# EAGLE schematic 261503933xxxx_HW-V2 (EAGLE 7.7.0)
PROJECT_NAME: Adrastea-I FeatherWing board

## Sheet 1 of 3
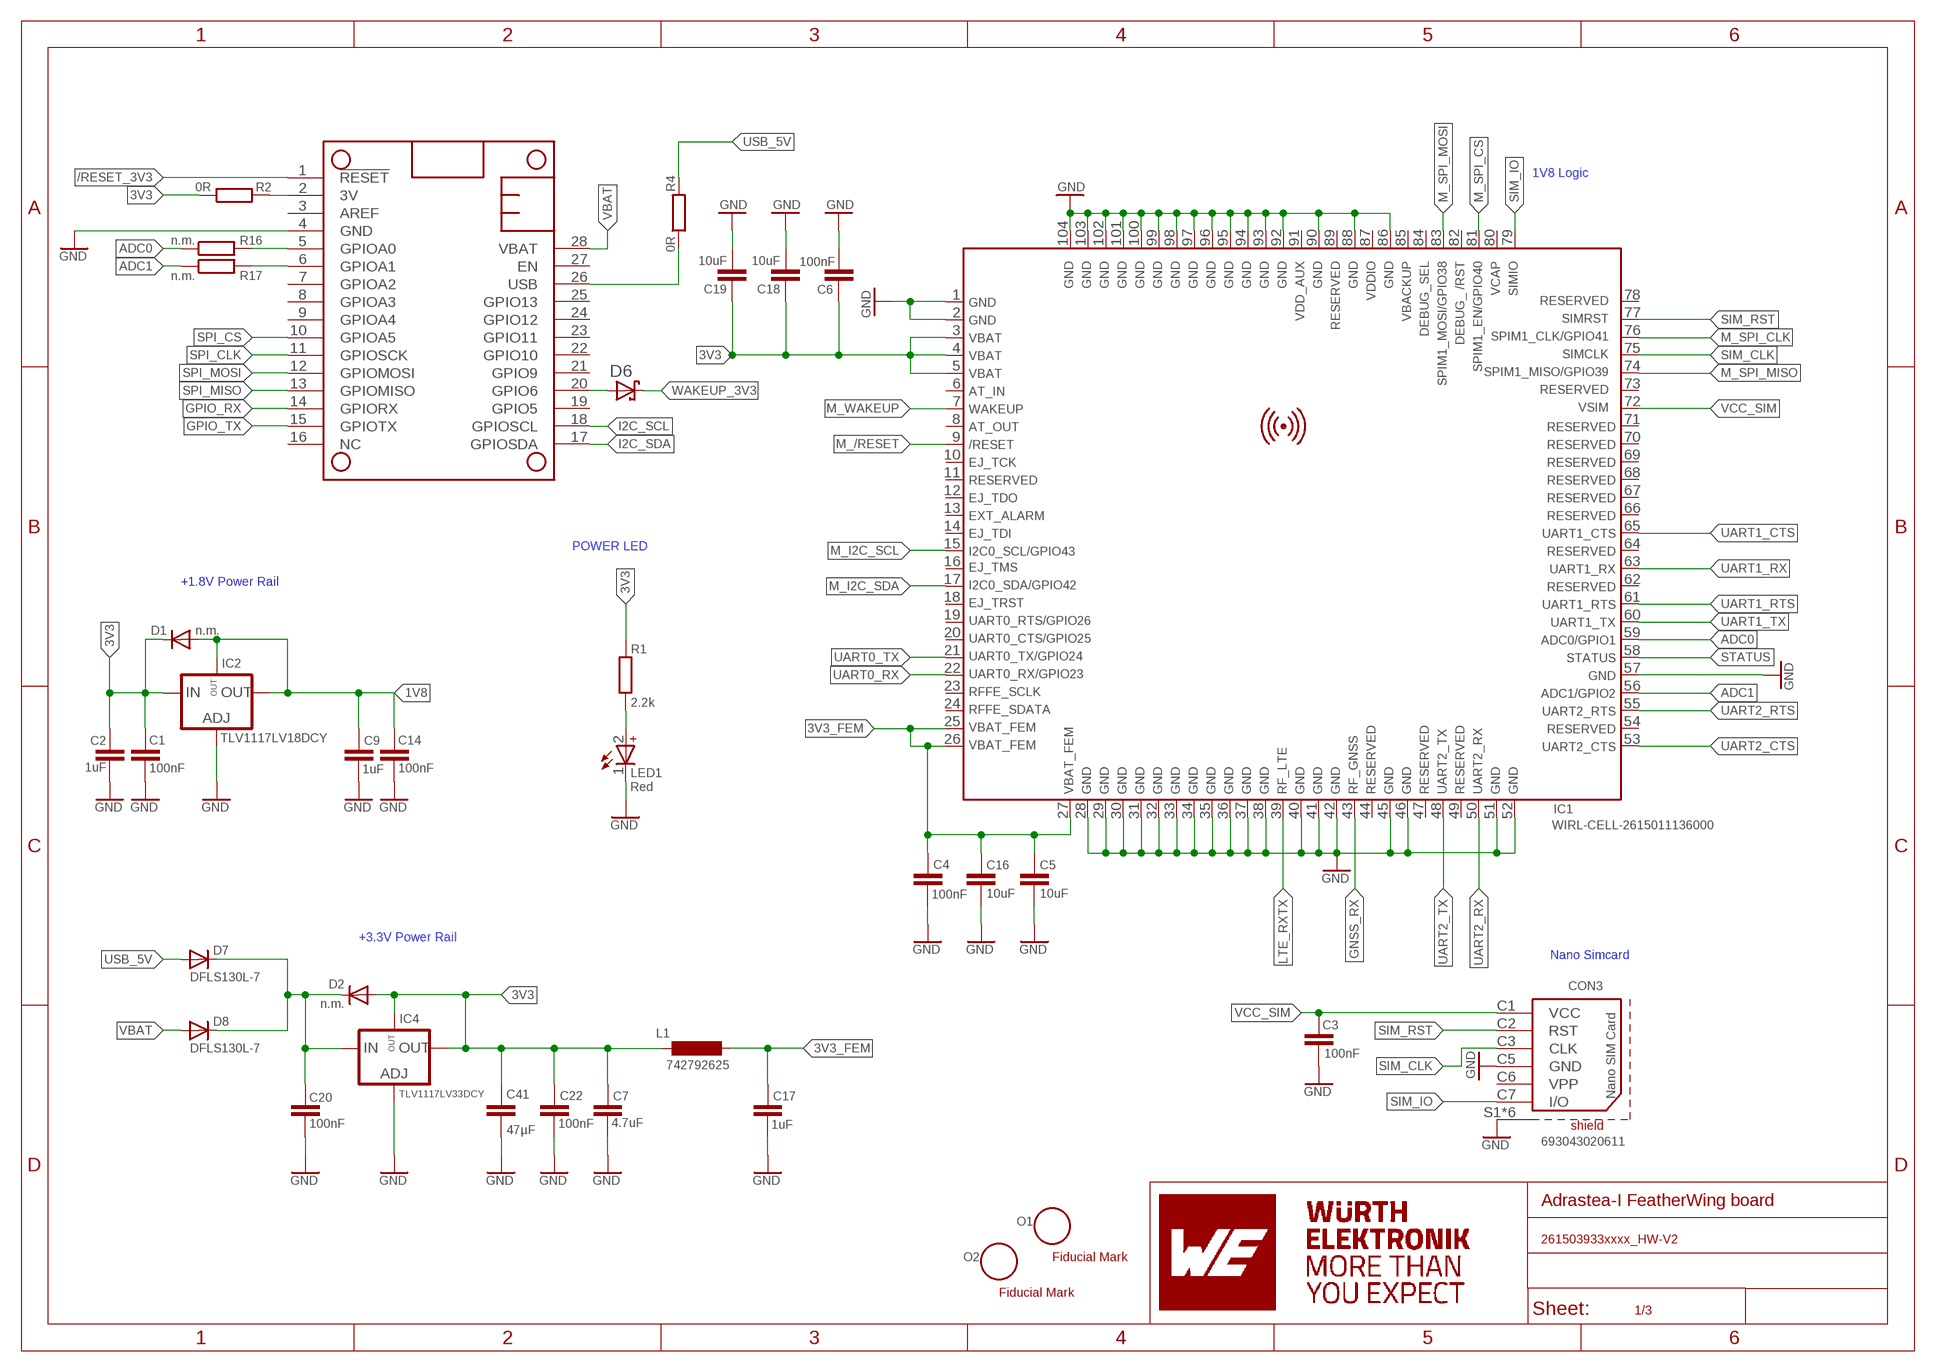
[diagram p0: schematic, sheet 1]

### Parts
C1  100nF  C0402_IPC  [C0402_IPC]
C2  1uF  C1UF0402_IPC  [C0402_IPC]
C3  100nF  C100NF0402_IPC  [C0402_IPC]
C4  100nF  C0402_IPC  [C0402_IPC]
C5  10uF  C0402_IPC  [C0402_IPC]
C6  100nF  C0402_IPC  [C0402_IPC]
C7  4.7uF  C4.7UF0402_IPC  [C0402_IPC]
C9  1uF  C1UF0402_IPC  [C0402_IPC]
C14  100nF  C0402_IPC  [C0402_IPC]
C16  10uF  C0402_IPC  [C0402_IPC]
C17  1uF  C1UF0402_IPC  [C0402_IPC]
C18  10uF  C0402_IPC  [C0402_IPC]
C19  10uF  C0402_IPC  [C0402_IPC]
C20  100nF  C0402_IPC  [C0402_IPC]
C22  100nF  C0402_IPC  [C0402_IPC]
C41  47µF  C47UF0805  [C0805]
CON3  693043020611  [693043020611]
D1  n.m.  BAS16  [SOT23@1]
D2  n.m.  BAS16  [SOT23@1]
D6  BAT540402_X1-DFN1006-2  [X1-DFN1006-2]
D7  DFLS130L-7  [SOD123_POWERDI]
D8  DFLS130L-7  [SOD123_POWERDI]
IC1  WIRL-CELL-2615011136000  [WIRL-CELL-2615011136000]
IC2  TLV1117LV18DCY  TLV1117-XXIDCYR  [SOT223-4]
IC4  TLV1117LV33DCY  TLV1117-XXIDCYR  [SOT223-4]
L1  742792625  LL0603_WE-MK  [L0603_WE-MK]
LED1  Red  WL-SMSW_1204_155124RS73200  [WL-SMSW_1204_A]
MS1  FEATHERWING_80MM  [FEATHERWING_80MM]
O1  OPT_MARKE05  [OPT_M_05]
O2  OPT_MARKE05  [OPT_M_05]
R1  2.2k  R2K20402_IPC  [R0402_IPC]
R2  0R  R0R0603_IPC  [R0603_IPC]
R4  0R  R0R0603_IPC  [R0603_IPC]
R16  n.m.  R0402_IPC  [R0402_IPC]
R17  n.m.  R0402_IPC  [R0402_IPC]

### Nets
1V8: C9.1 C14.2 D1.1(A) IC2.2(OUT) IC2.4(OUT) ; also sheet 2
3V: MS1.2(3V) R2.2
3V3: C1.2 C2.1 C6.2 C7.1 C18.1 C19.1 C22.2 C41.P$1 D1.3(C) D2.1(A) IC1.3(VBAT) IC1.4(VBAT) IC1.5(VBAT) IC2.3(IN) IC4.2(OUT) IC4.4(OUT) L1.1 R1.2 R2.1 ; also sheet 2,3
3V3_FEM: C4.2 C5.1 C16.1 C17.1 IC1.25(VBAT_FEM) IC1.26(VBAT_FEM) IC1.27(VBAT_FEM) L1.2
5V_IN: C20.2 D2.3(C) D7.K(C) D8.K(C) IC4.3(IN)
/RESET_3V3: MS1.1(!RESET) ; also sheet 2
ADC0: IC1.59(ADC0/GPIO1) R16.1
ADC1: IC1.56(ADC1/GPIO2) R17.1
ADC_0: MS1.5(GPIOA0) R16.2
ADC_1: MS1.6(GPIOA1) R17.2
FEATHER_USB: MS1.26(USB) R4.1
GND: C1.1 C2.2 C3.2 C4.1 C5.2 C6.1 C7.2 C9.2 C14.1 C16.2 C17.2 C18.2 C19.2 C20.1 C22.1 C41.P$2 CON3.C5(GND) CON3.S1(SHIELD) CON3.S2(SHIELD) CON3.S3(SHIELD) CON3.S4(SHIELD) CON3.S5(SHIELD) CON3.S6(SHIELD) IC1.1(GND) IC1.2(GND) IC1.28(GND) IC1.29(GND) IC1.30(GND) IC1.31(GND) IC1.32(GND) IC1.33(GND) IC1.34(GND) IC1.35(GND) IC1.36(GND) IC1.37(GND) IC1.38(GND) IC1.40(GND) IC1.41(GND) IC1.42(GND) IC1.45(GND) IC1.46(GND) IC1.51(GND) IC1.52(GND) IC1.57(GND) IC1.86(GND) IC1.88(GND) IC1.90(GND) IC1.92(GND) IC1.93(GND) IC1.94(GND) IC1.95(GND) IC1.96(GND) IC1.97(GND) IC1.98(GND) IC1.99(GND) IC1.100(GND) IC1.101(GND) IC1.102(GND) IC1.103(GND) IC1.104(GND) IC2.1(ADJ) IC4.1(ADJ) LED1.1(-) MS1.4(GND) ; also sheet 2,3
GNSS_RX: IC1.43(RF_GNSS_ANT) ; also sheet 2
GPIO_RX: MS1.14(GPIORX) ; also sheet 2,3
GPIO_TX: MS1.15(GPIOTX) ; also sheet 2,3
I2C_SCL: MS1.18(GPIOSCL) ; also sheet 2
I2C_SDA: MS1.17(GPIOSDA) ; also sheet 2
LTE_RXTX: IC1.39(RF_RXTX) ; also sheet 2
M_/RESET: IC1.9(/RESET) ; also sheet 2
M_I2C_SCL: IC1.15(I2C0_SCL/GPIO43) ; also sheet 2
M_I2C_SDA: IC1.17(I2C0_SDA/GPIO42) ; also sheet 2
M_SPI_CLK: IC1.76(SPIM1_CLK/GPIO41) ; also sheet 2
M_SPI_CS: IC1.81(SPIM1_EN/GPIO40) ; also sheet 2
M_SPI_MISO: IC1.74(SPIM1_MISO/GPIO39) ; also sheet 2
M_SPI_MOSI: IC1.83(SPIM1_MOSI/GPIO38) ; also sheet 2
M_WAKEUP: IC1.7(WAKEUP) ; also sheet 2
N$1: LED1.2(+) R1.1
N$3: D6.2(A) MS1.20(GPIO6)
SIM_CLK: CON3.C3(CLK) IC1.75(SIMCLK)
SIM_IO: CON3.C7(I/O) IC1.79(SIMIO)
SIM_RST: CON3.C2(RST) IC1.77(SIMRST)
SPI_CLK: MS1.11(GPIOSCK) ; also sheet 2
SPI_CS: MS1.10(GPIOA5) ; also sheet 2
SPI_MISO: MS1.13(GPIOMISO) ; also sheet 2
SPI_MOSI: MS1.12(GPIOMOSI) ; also sheet 2
STATUS: IC1.58(STATUS) ; also sheet 2
UART0_RX: IC1.22(UART0_RX/GPIO23) ; also sheet 2
UART0_TX: IC1.21(UART0_TX/GPIO24) ; also sheet 2
UART1_CTS: IC1.65(UART1_CTS) ; also sheet 2
UART1_RTS: IC1.61(UART1_RTS) ; also sheet 2
UART1_RX: IC1.63(UART1_RX) ; also sheet 2
UART1_TX: IC1.60(UART1_TX) ; also sheet 2
UART2_CTS: IC1.53(UART2_CTS) ; also sheet 2
UART2_RTS: IC1.55(UART2_RTS) ; also sheet 2
UART2_RX: IC1.50(UART2_RX) ; also sheet 2
UART2_TX: IC1.48(UART2_TX) ; also sheet 2
USB_5V: D7.A R4.2 ; also sheet 2,3
VBAT: D8.A MS1.28(VBAT) ; also sheet 2
VCC_SIM: C3.1 CON3.C1(VCC) IC1.72(VSIM)
WAKEUP_3V3: D6.1(C) ; also sheet 2
Unconnected: CON3.C6(VPP) IC1.6(AT_IN) IC1.8(PMU_AT_OUT) IC1.10(EJ_TCK) IC1.11(RESERVED14) IC1.12(EJ_TDO) IC1.13(EXT_ALARM) IC1.14(EJ_TDI) IC1.16(EJ_TMS) IC1.18(EJ_TRST) IC1.19(UART0_RTS/GPIO26) IC1.20(UART0_CTS/GPIO25) IC1.23(RFFE_SCLK) IC1.24(RFFE_SDATA) IC1.44(RESERVED5) IC1.47(RESERVED6) IC1.49(RESERVED7) IC1.54(RESERVED15) IC1.62(RESERVED1) IC1.64(RESERVED2) IC1.66(RESERVED8) IC1.67(RESERVED3) IC1.68(RESERVED9) IC1.69(RESERVED4) IC1.70(RESERVED16) IC1.71(RESERVED10) IC1.73(RESERVED11) IC1.78(RESERVED13) IC1.80(VCAP) IC1.82(DEBUG_/RST) IC1.84(DEBUG_SEL) IC1.85(VBACKUP) IC1.87(VDDIO) IC1.89(RESERVED12) IC1.91(VDD_AUX) MS1.3(AREF) MS1.7(GPIOA2) MS1.8(GPIOA3) MS1.9(GPIOA4) MS1.16(NC) MS1.19(GPIO5) MS1.21(GPIO9) MS1.22(GPIO10) MS1.23(GPIO11) MS1.24(GPIO12) MS1.25(GPIO13) MS1.27(EN)

### Notes on the sheet
- 1V8 Logic
- POWER LED
- +1.8V Power Rail
- +3.3V Power Rail
- Nano Simcard

## Sheet 2 of 3
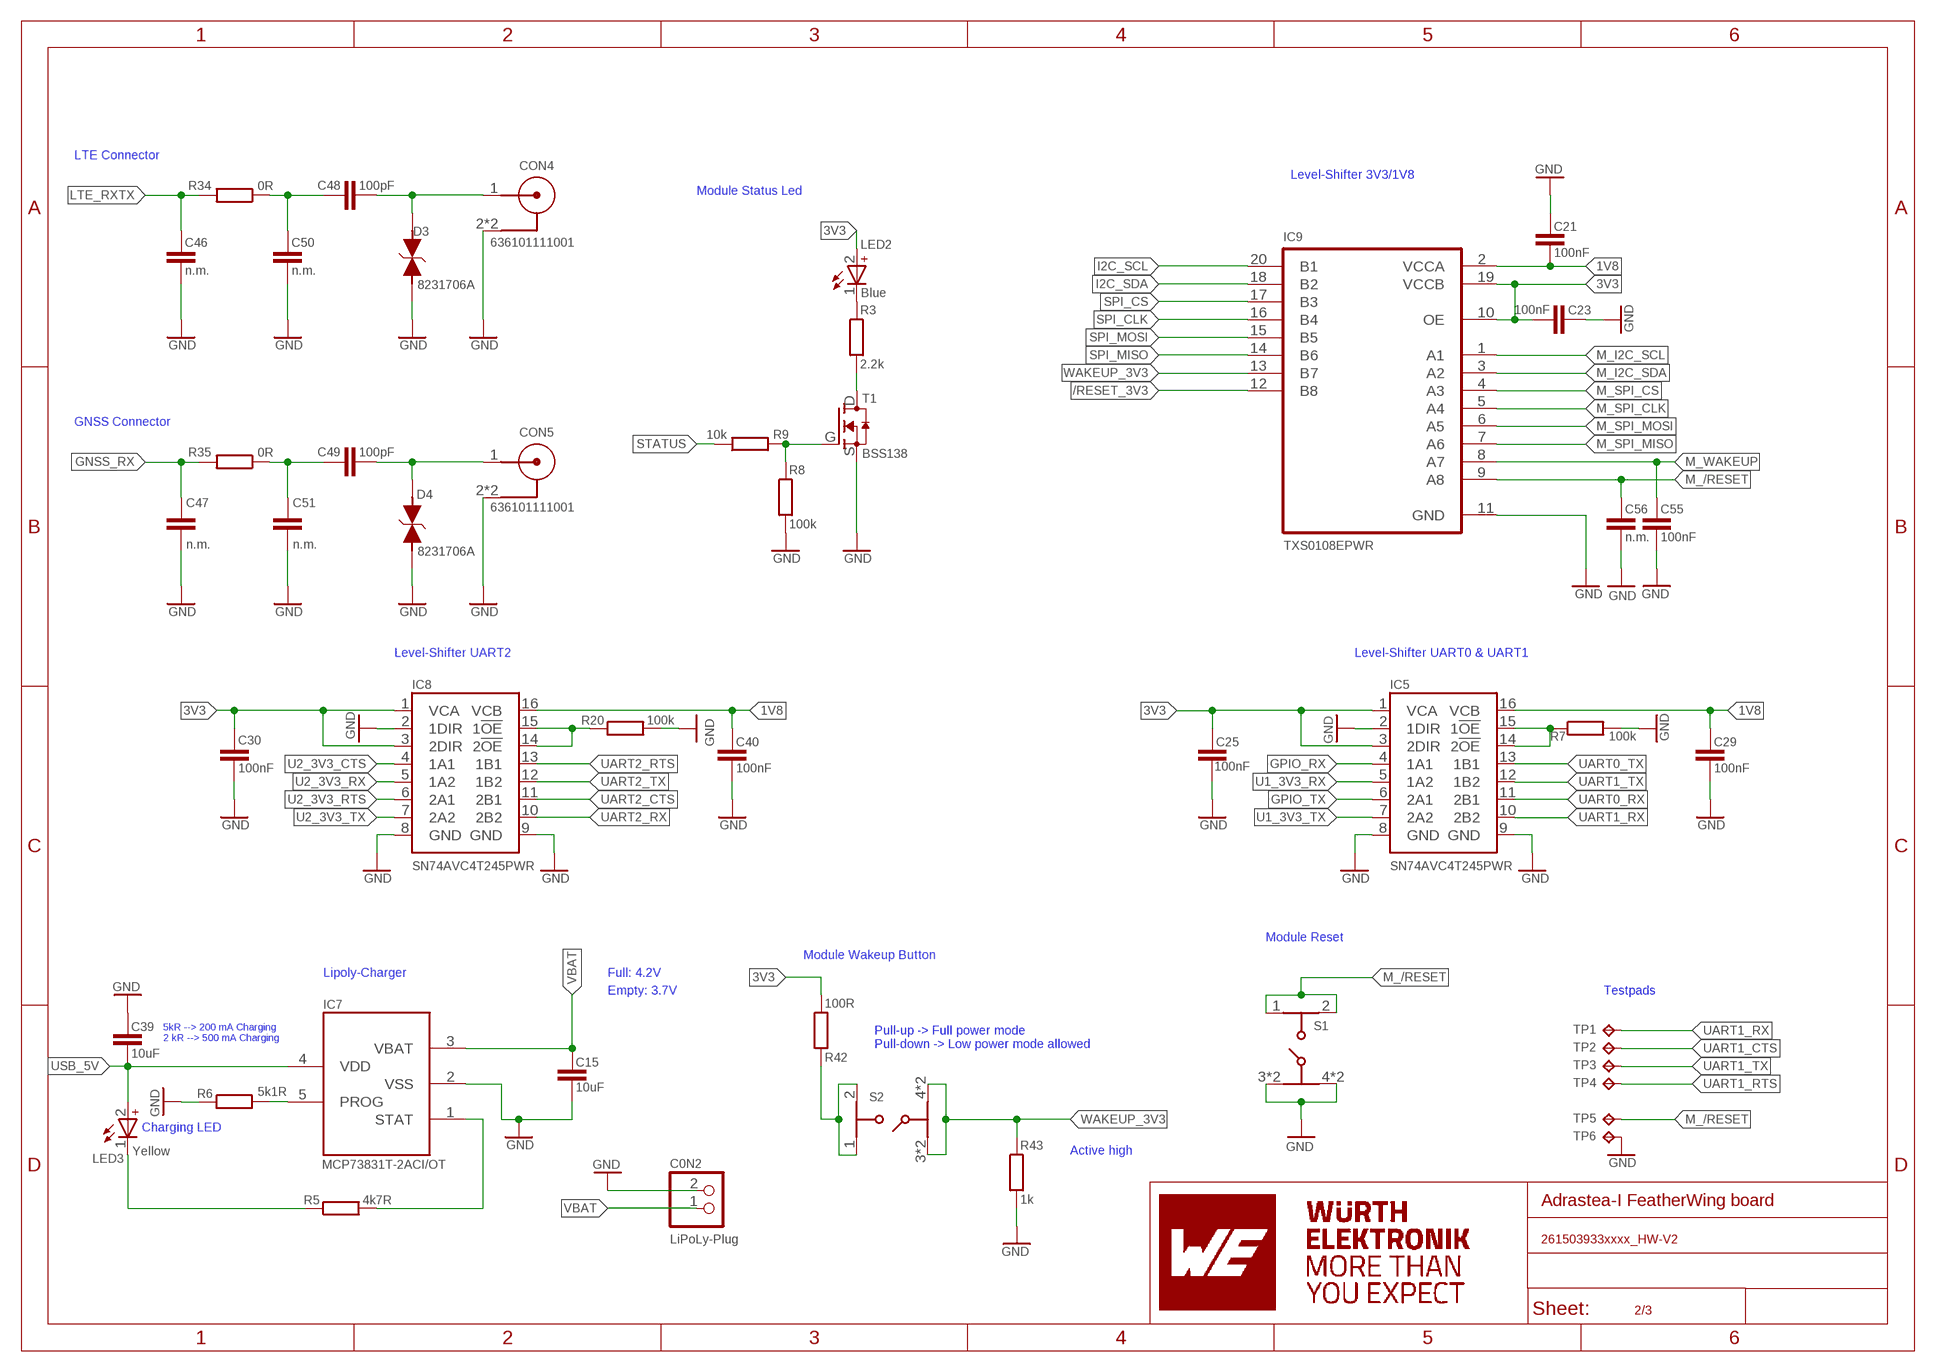
[diagram p1: schematic, sheet 2]

### Parts
C0N2  LiPoLy-Plug  JST_2PIN  [JST-PH-2-SMT-RA-ADRASTEA-ANGEPASST]
C15  10uF  C10UF0402_IPC  [C0402_IPC]
C21  100nF  C0402_IPC  [C0402_IPC]
C23  100nF  C0402_IPC  [C0402_IPC]
C25  100nF  C0402_IPC  [C0402_IPC]
C29  100nF  C0402_IPC  [C0402_IPC]
C30  100nF  C0402_IPC  [C0402_IPC]
C39  10uF  C1UF0603_IPC  [C0603_IPC]
C40  100nF  C0402_IPC  [C0402_IPC]
C46  n.m.  C0402_IPC  [C0402_IPC]
C47  n.m.  C0402_IPC  [C0402_IPC]
C48  100pF  C100PF0402_IPC  [C0402_IPC]
C49  100pF  C0402_IPC  [C0402_IPC]
C50  n.m.  C0402_IPC  [C0402_IPC]
C51  n.m.  C0402_IPC  [C0402_IPC]
C55  100nF  C0402_IPC  [C0402_IPC]
C56  n.m.  C0402_IPC  [C0402_IPC]
CON4  636101111001  [636101111001]
CON5  636101111001  [636101111001]
D3  8231706A  WE-VE_FEMTOF_0402_8231714A  [WE-VE_FEMTOF_0402]
D4  8231706A  WE-VE_FEMTOF_0402_8231714A  [WE-VE_FEMTOF_0402]
IC5  SN74AVC4T245PWR  [PW16(TSSOP16)]
IC7  MCP73831T-2ACI/OT  [SOT23-5]
IC8  SN74AVC4T245PWR  [PW16(TSSOP16)]
IC9  TXS0108EPWR  [SOP65P640X120-20N]
LED2  Blue  WL-SMSW_1204_155124BS73200  [WL-SMSW_1204_A]
LED3  Yellow  WL-SMSW_1204_155124RS73200  [WL-SMSW_1204_A]
R3  2.2k  R2K20402_IPC  [R0402_IPC]
R5  4k7R  R4K70402_IPC  [R0402_IPC]
R6  5k1R  R56R0402_IPC  [R0402_IPC]
R7  100k  R100KR0402_IPC  [R0402_IPC]
R8  100k  R100KR0402_IPC  [R0402_IPC]
R9  10k  R10KR0402_IPC  [R0402_IPC]
R20  100k  R100KR0402_IPC  [R0402_IPC]
R34  0R  R0R0402_IPC  [R0402_IPC]
R35  0R  R0R0402_IPC  [R0402_IPC]
R42  100R  R100R0402_IPC  [R0402_IPC]
R43  1k  R1K0402_IPC  [R0402_IPC]
S1  434331013822  [434331013822]
S2  434331013822  [434331013822]
T1  BSS138  [BSS138]
TP1  TP15R  [TP15R]
TP2  TP15R  [TP15R]
TP3  TP15R  [TP15R]
TP4  TP15R  [TP15R]
TP5  TP15R  [TP15R]
TP6  TP15R  [TP15R]

### Nets
1V8: C21.1 C29.2 C40.2 IC5.16(VCB) IC8.16(VCB) IC9.2(VCCA) ; also sheet 1
3V3: C23.1 C25.2 C30.2 IC5.1(VCA) IC5.3(2DIR) IC8.1(VCA) IC8.3(2DIR) IC9.10(OE) IC9.19(VCCB) LED2.2(+) R42.1 ; also sheet 1,3
/RESET_3V3: IC9.12(B8) ; also sheet 1
GND: C0N2.2 C15.2 C21.2 C23.2 C25.1 C29.1 C30.1 C39.1 C40.1 C46.1 C47.1 C50.1 C51.1 C55.1 C56.1 CON4.2 CON4.3 CON5.2 CON5.3 D3.2 D4.2 IC5.2(1DIR) IC5.8(GND) IC5.9(GND) IC7.2(VSS) IC8.2(1DIR) IC8.8(GND) IC8.9(GND) IC9.11(GND) R6.1 R7.2 R8.2 R20.2 R43.2 S1.3 S1.4 S1.5 S1.6 T1.S TP6.P$1(TP) ; also sheet 1,3
GNSS_RX: C47.2 R35.2 ; also sheet 1
GPIO_RX: IC5.4(1A1) ; also sheet 1,3
GPIO_TX: IC5.6(2A1) ; also sheet 1,3
I2C_SCL: IC9.20(B1) ; also sheet 1
I2C_SDA: IC9.18(B2) ; also sheet 1
LS_ISO_CTRL1: IC8.14(2!OE) IC8.15(1!OE) R20.1
LTE_RXTX: C46.2 R34.2 ; also sheet 1
M_/RESET: C56.2 IC9.9(A8) S1.1 S1.2 TP5.P$1(TP) ; also sheet 1
M_I2C_SCL: IC9.1(A1) ; also sheet 1
M_I2C_SDA: IC9.3(A2) ; also sheet 1
M_SPI_CLK: IC9.5(A4) ; also sheet 1
M_SPI_CS: IC9.4(A3) ; also sheet 1
M_SPI_MISO: IC9.7(A6) ; also sheet 1
M_SPI_MOSI: IC9.6(A5) ; also sheet 1
M_WAKEUP: C55.2 IC9.8(A7) ; also sheet 1
N$2: LED2.1(-) R3.1
N$4: C49.1 CON5.1 D4.1
N$6: C48.1 CON4.1 D3.1
N$7: R42.2 S2.1 S2.2
N$8: C48.2 C50.2 R34.1
N$9: R3.2 T1.D
N$10: C49.2 C51.2 R35.1
N$12: R8.1 R9.2 T1.G
N$15: LED3.1(-) R5.1
N$16: IC7.5(PROG) R6.2
N$17: IC5.14(2!OE) IC5.15(1!OE) R7.1
SPI_CLK: IC9.16(B4) ; also sheet 1
SPI_CS: IC9.17(B3) ; also sheet 1
SPI_MISO: IC9.14(B6) ; also sheet 1
SPI_MOSI: IC9.15(B5) ; also sheet 1
STAT: IC7.1(STAT) R5.2
STATUS: R9.1 ; also sheet 1
U1_3V3_RX: IC5.5(1A2) ; also sheet 3
U1_3V3_TX: IC5.7(2A2) ; also sheet 3
U2_3V3_CTS: IC8.4(1A1) ; also sheet 3
U2_3V3_RTS: IC8.6(2A1) ; also sheet 3
U2_3V3_RX: IC8.5(1A2) ; also sheet 3
U2_3V3_TX: IC8.7(2A2) ; also sheet 3
UART0_RX: IC5.11(2B1) ; also sheet 1
UART0_TX: IC5.13(1B1) ; also sheet 1
UART1_CTS: TP2.P$1(TP) ; also sheet 1
UART1_RTS: TP4.P$1(TP) ; also sheet 1
UART1_RX: IC5.10(2B2) TP1.P$1(TP) ; also sheet 1
UART1_TX: IC5.12(1B2) TP3.P$1(TP) ; also sheet 1
UART2_CTS: IC8.11(2B1) ; also sheet 1
UART2_RTS: IC8.13(1B1) ; also sheet 1
UART2_RX: IC8.10(2B2) ; also sheet 1
UART2_TX: IC8.12(1B2) ; also sheet 1
USB_5V: C39.2 IC7.4(VDD) LED3.2(+) ; also sheet 1,3
VBAT: C0N2.1 C15.1 IC7.3(VBAT) ; also sheet 1
WAKEUP_3V3: IC9.13(B7) R43.1 S2.3 S2.4 S2.5 S2.6 ; also sheet 1

### Notes on the sheet
- LTE Connector
- Level-Shifter 3V3/1V8
- Module Status Led
- GNSS Connector
- Level-Shifter UART2 | Level-Shifter UART0 & UART1
- Module Reset
- Module Wakeup Button
- Lipoly-Charger | Full: 4.2V
- Empty: 3.7V | Testpads
- 5kR --> 200 mA Charging
- 2 kR --> 500 mA Charging
- Pull-up -> Full power mode
  Pull-down -> Low power mode allowed
- Charging LED
- Active high

## Sheet 3 of 3
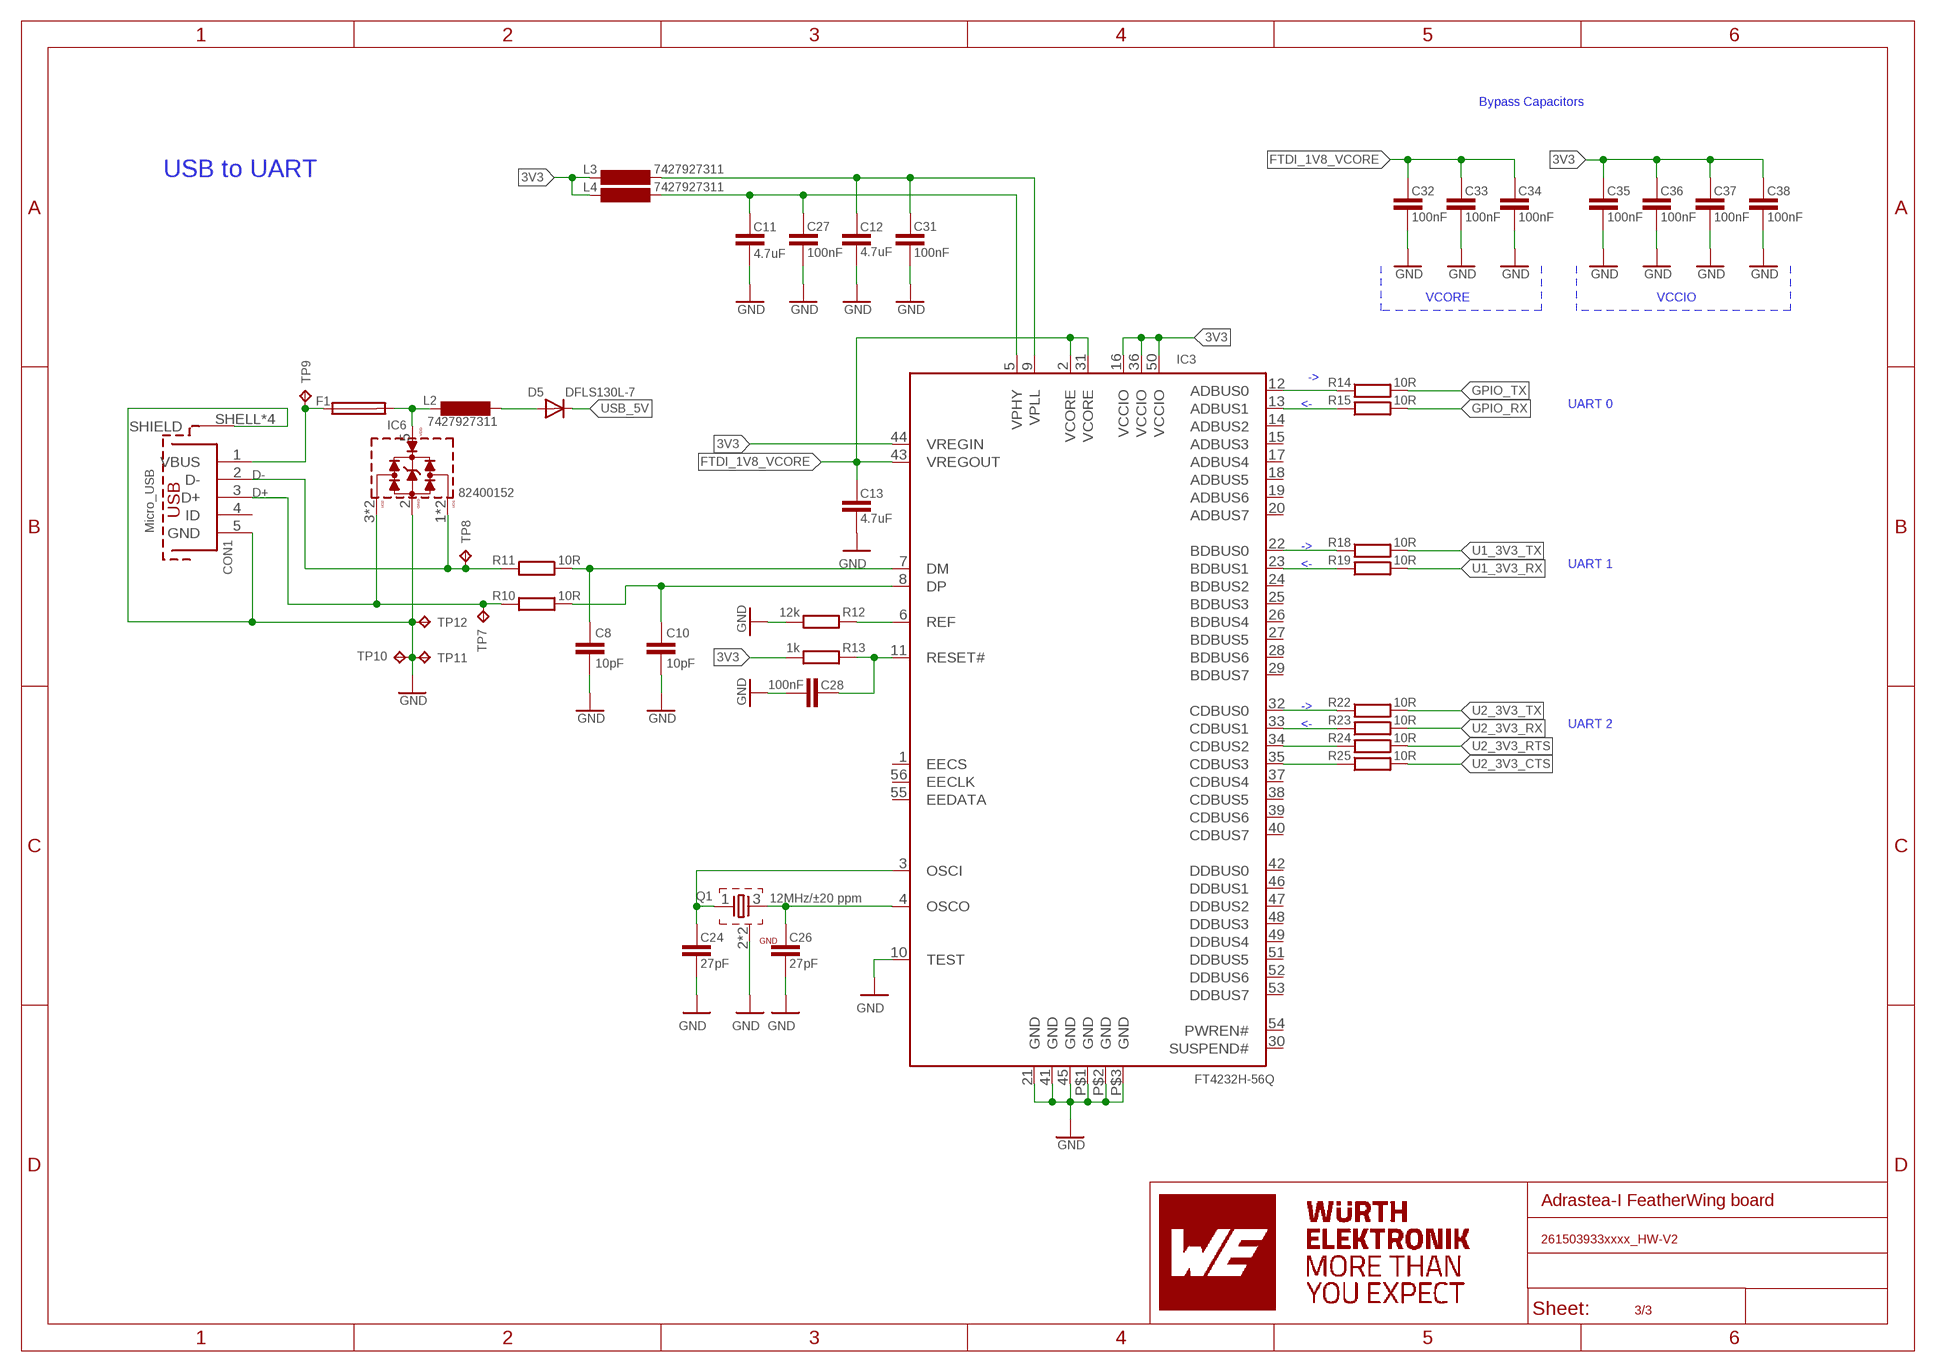
[diagram p2: schematic, sheet 3]

### Parts
C8  10pF  C10PF0402_IPC  [C0402_IPC]
C10  10pF  C10PF0402_IPC  [C0402_IPC]
C11  4.7uF  C4.7UF0402_IPC  [C0402_IPC]
C12  4.7uF  C4.7UF0402_IPC  [C0402_IPC]
C13  4.7uF  C4.7UF0402_IPC  [C0402_IPC]
C24  27pF  C27P0402_IPC  [C0402_IPC]
C26  27pF  C27P0402_IPC  [C0402_IPC]
C27  100nF  C0402_IPC  [C0402_IPC]
C28  100nF  C0402_IPC  [C0402_IPC]
C31  100nF  C0402_IPC  [C0402_IPC]
C32  100nF  C0402_IPC  [C0402_IPC]
C33  100nF  C0402_IPC  [C0402_IPC]
C34  100nF  C0402_IPC  [C0402_IPC]
C35  100nF  C0402_IPC  [C0402_IPC]
C36  100nF  C0402_IPC  [C0402_IPC]
C37  100nF  C0402_IPC  [C0402_IPC]
C38  100nF  C0402_IPC  [C0402_IPC]
CON1  Micro_USB  629105150521  [629105150521]
D5  DFLS130L-7  [SOD123_POWERDI]
F1  ERB-RD1R50X  [0402]
IC3  FT4232H-56Q  [VQFN-56]
IC6  82400152  WE-TVS_82400152  [WE-TVS_SOT563]
L2  7427927311  LL0402_WE-MK  [L0402_WE-MK]
L3  7427927311  LL0402_WE-MK  [L0402_WE-MK]
L4  7427927311  LL0402_WE-MK  [L0402_WE-MK]
Q1  12MHz/±20 ppm  WE-XTAL_CFPX-180_830070868  [WE-XTAL_CFPX-180]
R10  10R  R10R0402_IPC  [R0402_IPC]
R11  10R  R10R0402_IPC  [R0402_IPC]
R12  12k  R12K0402_IPC  [R0402_IPC]
R13  1k  R1K0402_IPC  [R0402_IPC]
R14  10R  R10R0402_IPC  [R0402_IPC]
R15  10R  R10R0402_IPC  [R0402_IPC]
R18  10R  R10R0402_IPC  [R0402_IPC]
R19  10R  R10R0402_IPC  [R0402_IPC]
R22  10R  R10R0402_IPC  [R0402_IPC]
R23  10R  R10R0402_IPC  [R0402_IPC]
R24  10R  R10R0402_IPC  [R0402_IPC]
R25  10R  R10R0402_IPC  [R0402_IPC]
TP7  TP15R  [TP15R]
TP8  TP15R  [TP15R]
TP9  TP15R  [TP15R]
TP10  TP15R  [TP15R]
TP11  TP15R  [TP15R]
TP12  TP15R  [TP15R]

### Nets
3V3: C35.2 C36.2 C37.2 C38.2 IC3.16(VCCIO) IC3.36(VCCIO) IC3.44(VREGIN) IC3.50(VCCIO) L3.P$2 L4.P$2 R13.1 ; also sheet 1,2
D+: CON1.3(D+) IC6.3(I/O2) IC6.4(I/O2) R10.1 TP7.P$1(TP)
D-: CON1.2(D-) IC6.1(I/O1) IC6.6(I/O1) R11.2 TP8.P$1(TP)
FTDI_1V8_VCORE: C13.1 C32.2 C33.2 C34.2 IC3.2(VCORE) IC3.31(VCORE) IC3.43(VREGOUT)
FTDI_CTS#_CH-C: IC3.35(CDBUS3) R25.1
FTDI_RESET: C28.2 IC3.11(RESET#) R13.2
FTDI_RTS#_CH-C: IC3.34(CDBUS2) R24.1
FTDI_RXD_CH-A: IC3.13(ADBUS1) R15.1
FTDI_RXD_CH-B: IC3.23(BDBUS1) R19.1
FTDI_RXD_CH-C: IC3.33(CDBUS1) R23.1
FTDI_TXD_CH-A: IC3.12(ADBUS0) R14.1
FTDI_TXD_CH-B: IC3.22(BDBUS0) R18.1
FTDI_TXD_CH-C: IC3.32(CDBUS0) R22.1
GND: C8.1 C10.1 C11.2 C12.2 C13.2 C24.1 C26.1 C27.1 C28.1 C31.1 C32.1 C33.1 C34.1 C35.1 C36.1 C37.1 C38.1 CON1.5(GND) CON1.SHELL1(SHIELD) CON1.SHELL2(SHIELD) CON1.SHELL3(SHIELD) CON1.SHELL(SHIELD) IC3.10(TEST) IC3.21(GND) IC3.41(GND) IC3.45(GND) IC3.P$1(GND) IC3.P$2(GND) IC3.P$3(GND) IC6.2(GND) Q1.2(GND) Q1.4(GND) R12.1 TP10.P$1(TP) TP11.P$1(TP) TP12.P$1(TP) ; also sheet 1,2
GPIO_RX: R15.2 ; also sheet 1,2
GPIO_TX: R14.2 ; also sheet 1,2
N$5: C8.2 IC3.7(DM) R11.1
N$11: C10.2 IC3.8(DP) R10.2
N$13: D5.A L2.P$1
N$14: F1.2 IC6.5(VDD) L2.P$2
N$30: C11.1 C27.2 IC3.5(VPHY) L4.P$1
N$31: C12.1 C31.2 IC3.9(VPLL) L3.P$1
N$33: IC3.6(REF) R12.2
N$34: C24.2 IC3.3(OSCI) Q1.1
N$35: C26.2 IC3.4(OSCO) Q1.3
U1_3V3_RX: R19.2 ; also sheet 2
U1_3V3_TX: R18.2 ; also sheet 2
U2_3V3_CTS: R25.2 ; also sheet 2
U2_3V3_RTS: R24.2 ; also sheet 2
U2_3V3_RX: R23.2 ; also sheet 2
U2_3V3_TX: R22.2 ; also sheet 2
USB_5V: D5.K(C) ; also sheet 1,2
VBUS: CON1.1(VBUS) F1.1 TP9.P$1(TP)
Unconnected: CON1.4(ID) IC3.1(EECS) IC3.14(ADBUS2) IC3.15(ADBUS3) IC3.17(ADBUS4) IC3.18(ADBUS5) IC3.19(ADBUS6) IC3.20(ADBUS7) IC3.24(BDBUS2) IC3.25(BDBUS3) IC3.26(BDBUS4) IC3.27(BDBUS5) IC3.28(BDBUS6) IC3.29(BDBUS7) IC3.30(SUSPEND#) IC3.37(CDBUS4) IC3.38(CDBUS5) IC3.39(CDBUS6) IC3.40(CDBUS7) IC3.42(DDBUS0) IC3.46(DDBUS1) IC3.47(DDBUS2) IC3.48(DDBUS3) IC3.49(DDBUS4) IC3.51(DDBUS5) IC3.52(DDBUS6) IC3.53(DDBUS7) IC3.54(PWREN#) IC3.55(EEDATA) IC3.56(EECLK)

### Notes on the sheet
- Bypass Capacitors
- USB to UART
- VCORE | VCCIO
- ->
- <- | UART 0
- ->
- <- | UART 1
- ->
- <- | UART 2

## Library data of the parts
C0N2 = adafruit:JST_2PIN: JST 2-Pin Connectors of various flavors SMT-RA (S2B-PH-SM4) 4UConnector #17311 SMT (B2B-PH-SM4) THM-RA (S2B-PH) THM (B2B-PH); HEIGHT: 9mm; MANUFACTURER: Adafruit; NR: 1769; PACK: SMT
C1 C4 C6 C14 C20-C23 C25 C27-C38 C40 C55 = rcl-amber:C; HEIGHT: 0.5mm; MANUFACTURER: Würth Elektronik; MAT: X7R; NR: 885012205037; PACK: 0402; SPG: 16V; TOL: 10%
C2 C9 C17 = rcl-WE:C; HEIGHT: 0.5mm; MANUFACTURER: Würth Elektronik; MAT: X5R; NR: 885012105012; PACK: 0402; SPG: 10V; TOL: 20%
C3 = rcl-WE:C; HEIGHT: 0.5mm; MANUFACTURER: Würth Elektronik; MAT: X7R; NR: 885012205037; PACK: 0402; SPG: 16V; TEMP: -55 to +125°C; TOL: 10%
C5 C18 C19 = rcl-WE:C; HEIGHT: 0.5mm; MANUFACTURER: Würth Elektronik; NR: 885012105020; PACK: 0402; SPG: 6,3V
C7 C11-C13 = rcl-WE:C; HEIGHT: 0.5mm; MANUFACTURER: Würth Elektronik; MAT: X5R; NR: 885012105008; PACK: 0402; SPG: 6.3V; TOL: 20%
C8 C10 = rcl-WE:C; HEIGHT: 0.5mm; MANUFACTURER: Würth Elektronik; MAT: NP0; NR: 885012005055; PACK: 0402; SPG: 50V; TOL: 5%
C15 = rcl-WE:C; HEIGHT: 0.5mm; MANUFACTURER: Würth Elektronik; MAT: X5R; NR: 885012105020; PACK: 0402; SPG: 6.3V; TEMP: -55 to +85°c; TOL: 20%
C16 = rcl-WE:C; HEIGHT: 0.5mm; MANUFACTURER: Würth Elektronik; MAT: X5R; NR: 885012105020; PACK: 0402; SPG: 6,3V; TOL: 20%
C24 C26 = rcl-amber:C; HEIGHT: 0.5mm; MANUFACTURER: Samsung; MAT: C0G; NR: CL05C270JB5NNNC; PACK: 0402; SPG: 50V; TOL: 5%
C39 = rcl-WE:C; HEIGHT: 0.8mm; MANUFACTURER: Wurth Elektronik; NR: 885012106031; PACKAGE: 0603; SPG: 25V; TOL: 10%
C41 = rcl-amber:C; HEIGHT: 1.25mm; MANUFACTURER: Wurth Elektronik; MAT: X7R; NR: 885012107006; PACKAGE: 0805; SPG: 6.3V; TOL: 20%
C46 C47 C50 C51 C56 = rcl-amber:C; HEIGHT: 0.5mm; MANUFACTURER: n.m.; NR: n.m.; PACK: 0402
C48 C49 = rcl-amber:C; HEIGHT: 0.5mm; MANUFACTURER: Würth Elektronik; MAT: NP0; NR: 885012005061; PACK: 0402; SPG: 50V; TOL: 5%
CON1 = WE_InputOutputIO (rev18a):629105150521: WR-COM_USB_Micro Type B_Horizontal_SMT ; Micro Type B Horizontal SMT - 3A current at Pin1 & Pin 5 - with Pegs and THT shielding Pins - T&R Packaging Code : Con_I-O_COM_USB_2.0_B_629105150521_629105150521 <http://katalog.we-online.de/media/images/eican/Con_I-O_COM_USB_2.0_B_629105150521_pf2.jpg> Details see: http://katalog.we-online.de/em/datasheet/629105150521.pdf Created 12/08/2014, Dan Xu 2014 (C) Wurth Elektronik; COMMENT: Use selective soldering; HEIGHT: 2.66mm; MANUFACTURER: Würth Elektronik; NR: 629105150521; PACK: SMT/THT
CON3 = 693023010811_Eagle_WR-CRD_rev20b:693043020611: WR-CRD Nano SIM Card Connector KIND PROPERTIES Quality Class:1 500 Mating cycles Gender:Socket Type:Push & Push General Information Operating Temperature:-25 up to +85 °C Compliance:RoHS Electrical Properties IR 1:1 A Working Voltage:15 V (AC) Withstanding Voltage:500 V (AC) Contact Resistance:100 mΩ Material Properties Insulator MateriaL:LCP Insulator Flammability Rating:UL94 V-0 Color:Black Contact Material:Copper Alloy Contact Plating:Selective Gold Contact Type{Stamped Shielding Material:Stainless Steel Shielding Plating:Nickel <https://www.we-online.de/katalog/media/o33068v209%20Family_WR-CRD_Nano_SIM_PushPull_6Pins_693043020611.jpg> Details see: https://www.we-online.de/katalog/en/CRD_NANO_SIM_PUSH_AND_PULL/ Created by Yingchun,Shan 2019-11-21 2019 (C) Würth Elektronik; DATASHEET-URL: https://www.we-online.com/catalog/datasheet/693043020611.pdf; GERDER: Socket; HEIGHT: 1,2mm; MOUNT: SMT; PART-NUMBER: 693043020611; PINS: 6; TYPE: Push & Push
CON4 CON5 = Eagle_WR-UMRF (rev21b):636101111001: WR-UMRF PCB Receptacle SMT with 3 Pads MATERIAL PROPERTIES Insulator Material LCP Insulator Color Natural Insulator Flammability Rating UL94 V-0 Center Contact Material Brass Center Contact Plating Gold over Nickel GENERAL INFORMATION Operating Temperature -40 up to +90 °C <https://www.we-online.com/katalog/media/o325314v209%20Single_WR-UMRF_63610111x001.jpg> Details see: https://www.we-online.com/katalog/en/PCB_RECECTACLE_SMT_WITH_3_PADS Updated by Ella Wu 2021-07-20 2021(C) Würth Elektronik; DATASHEET-URL: https://www.we-online.com/catalog/datasheet/636101111001.pdf; GENDER: PCB Receptacle; HEIGHT: 1,25mm; MOUNT: SMT; PART-NUMBER: 636101111001; Z: 50Ohm
D1 D2 = Diode:BAS16; HEIGHT: N/A; MANUFACTURER: n.m.; NR: n.m.; PACK: SMT
D3 D4 = 8231714A_Eagle_WE-VE femtoF_rev19a:WE-VE_FEMTOF_0402: WE-VE femtoF ESD Suppressor Characteristics Lowest Capacitance Fast response time Low leakage current Low clamping voltage Almost no energy consumption in stand-by mode Excellent absorption for ESD-impulses Operating temperature: –40 ºC to +85 ºC Nickel barrier Applications Protection of, data lines, bus systems or semiconductors ESD protection in accordance with EN 61000-4-2: 8 kV contact discharge 15 kV air discharge <https://katalog.we-online.de/media/images/v2/o157489v209%20Family_WE-VE_femtoF_0402_0603.jpg> Details see: https://katalog.we-online.de/en/pbs/WE-VE_FEMTOF Created by Ella Wu 2019-09-09 2019(C) Wurth Elektronik; CCH-TYP: 0.05pF; DATASHEET-URL: https://katalog.we-online.de/pbs/datasheet/8231714A.pdf; HEIGHT: 0.6mm; ILEAK: 0.05uA; MANUFACTURER: Würth Elektronik; MOUNT: SMT; NR: 8231706A; PACK: SMT; VALUE: 14V; VCH-TYP: 45V; VESD-AIR: 15kV; VESD-CONTACT: 8kV
D5 D7 D8 = Diode:DFLS130L-7: Diodes incorporated; HEIGHT: 1mm; MANUFACTURER: diodes inc; NR: DFLS130L-7; PACK: 123-2
D6 = Diode:BAT54: Schottky Diodes Source: Fairchild .. BAT54.pdf; HEIGHT: 0.5mm; MANUFACTURER: Diodes Inc.; NR: BAT54LP-7; PACK: 0402
F1 = fuse:ERB-RD1R50X: Micro Chip Fuse - Panasonic; HEIGHT: 0.5mm; MANUFACTURER: Panasonic; NR: ERB-RD1R50X
IC1 = WIRL-CELL-2615011136000:WIRL-CELL-2615011136000: Adrastea - Cellular Module Cat.M and NB-IoT WIRL-CELL Cellular Module T&R Details see: https://katalog.we-online.com/en/wco/WIRL-PRO2; HEIGHT: 1.85mm; MANUFACTURER: Wuerth Elektronik; NR: 2615011136000
IC2 = v-reg:TLV1117-XX; HEIGHT: 1.6mm; MANUFACTURER: Texas Instruments; MANUFACTURER2: ONsemi; NR: TLV1117LV18DCY; NR2: LM1117MPX-18N0PB; PACK: SMT
IC3 = ftdichip:FT4232H-56Q: FT4232H Quad High Speed USB to Multipurpose UART/MPSSE IC; HEIGHT: 0.9mm; MANUFACTURER: FTDI; NR: FT4232H-56Q
IC4 = v-reg:TLV1117-XX; HEIGHT: 1.6mm; MANUFACTURER: Texas Instruments; NR: TLV1117LV33DCY; PACK: SMT
IC5 IC8 = TI:SN74AVC4T245PW: Dual-Bit Bus Transceiver with Configurable Voltage Translation and 3-State Outputs; HEIGHT: 1.2mm; MANUFACTURER: Texas Instruments; NR: SN74AVC4T245PWR; PACK: SMT
IC6 = EMCComponents (rev17f):WE-TVS_82400152: TVS Diode High Speed Series Characteristics Low clamping voltage Sturdy design Very low capacitance Flow Thru Design for a simple layout Rail to Rail protection Epoxy flame resistant UL94 V-0 RoHS, REACH and free of halogens Applications Very fast data lines USB 2.0 Ethernet PoE VGA Sim Cards Keypads ESD protection in accordance with EN 61000-4-2, – 8 kV contact discharge – 15 kV air discharge <http://katalog.we-online.de/media/images/v2/Family_WE-TVS_HIGHSPEED.jpg> Details see: http://katalog.we-online.de/en/pbs/WE-TVS_High_Speed/824001? Updated by Dan Xu 2014-07-11 2014 (C) Wurth Elektronik; HEIGHT: 0.55m; MANUFACTURER: Würth Elektronik; NR: 82400152; PACK: SMT
IC7 = microchip:MCP73831T-2ACI/OT; HEIGHT: 1,3mm; MANUFACTURER: microchip; NR: MCP73831T-2ACI/OT; PACK: SOT-23
IC9 = TI:TXS0108EPWR; DESCRIPTION: 8-bit bidirectional voltage-level shifter for open-drain and push-pull application 20-TSSOP -40 to 85; HEIGHT: 1,2mm; MF: Texas Instruments; MP: TXS0108EPWR; PACKAGE: TSSOP-20 Texas Instruments
L1 = rcl-amber:L: Spule; HEIGHT: 0.8mm; ISAT: 1.5A; MANUFACTURER: Würth Elektronik; NR: 742792625; PACK: 0603; RDC: 0.05R; TOL: 25%
L2-L4 = rcl-amber:L: Spule; HEIGHT: 0.5mm; MANUFACTURER: Würth Elektronik; NR: 7427927311; PACK: 0402; TOL: 0.3nH
LED1 = 155124YS73200A_Eagle_WL-SMSW_rev20a:WL-SMSW_1204: WL-SMSW SMT Mono-color Side View Waterclear Characteristics High reliability Low current requirement No UV/IR radiation Wide viewing angle Excelllent for edge lighting LED displays and backlighting indicators Ideal for miniature applications Compatible with automatic placement equipment Applications Backlighting for LCD Sidelighting applications Indicator and backlighting for telecommunication Backlighting for symbols, switches and dashboards General LED lighting <https://www.we-online.com/catalog/media/o35735v209%20Family_WL-SMSW_1204_155124xx73200A.jpg> Details see: https://www.we-online.com/catalog/en/WL-SMSW/; HEIGHT: 1,5mm; MANUFACTURER: würth elektronik; NR: 155124RS73200; PACK: 1204
LED2 = 155124YS73200A_Eagle_WL-SMSW_rev20a:WL-SMSW_1204: WL-SMSW SMT Mono-color Side View Waterclear Characteristics High reliability Low current requirement No UV/IR radiation Wide viewing angle Excelllent for edge lighting LED displays and backlighting indicators Ideal for miniature applications Compatible with automatic placement equipment Applications Backlighting for LCD Sidelighting applications Indicator and backlighting for telecommunication Backlighting for symbols, switches and dashboards General LED lighting <https://www.we-online.com/catalog/media/o35735v209%20Family_WL-SMSW_1204_155124xx73200A.jpg> Details see: https://www.we-online.com/catalog/en/WL-SMSW/; HEIGHT: 1,5mm; MANUFACTURER: würth elektronik; NR: 155124BS73200; PACK: 1204
LED3 = 155124YS73200A_Eagle_WL-SMSW_rev20a:WL-SMSW_1204: WL-SMSW SMT Mono-color Side View Waterclear Characteristics High reliability Low current requirement No UV/IR radiation Wide viewing angle Excelllent for edge lighting LED displays and backlighting indicators Ideal for miniature applications Compatible with automatic placement equipment Applications Backlighting for LCD Sidelighting applications Indicator and backlighting for telecommunication Backlighting for symbols, switches and dashboards General LED lighting <https://www.we-online.com/catalog/media/o35735v209%20Family_WL-SMSW_1204_155124xx73200A.jpg> Details see: https://www.we-online.com/catalog/en/WL-SMSW/; HEIGHT: 1,5mm; MANUFACTURER: würth elektronik; NR: 155124YS73200; PACK: 1204
MS1 = adafruit_feather_long:FEATHERWING
O1 O2 = testpad_def:OPT_MARKE
Q1 = WE_EMCComponents (rev19c):WE-XTAL_CFPX-180: WE-XTAL Quartz Crystal Characteristics Industry standard packages <https://katalog.we-online.com/media/images/v2/o135919v209%20Family_WE-XTAL.jpg> Details see: https://katalog.we-online.com/en/pbs/WE-XTAL Created by Yingchun Shan,2018-11-19 2018 (C) Wurth Elektronik; HEIGHT: 0.8mm; MANUFACTURER: Würth Elektronik; NR: 830070868; PACK: SMT
R1 = rcl-amber:R; HEIGHT: 0.35mm; MANUFACTURER: Yageo; NR: RC0402FR-072K2L; PACK: 0402; TOL: 1%
R2 R4 = rcl-WE:R; HEIGHT: 0.45mm; MANUFACTURER: Yageo; NR: RC0603JR-070RL; P: 1/10W; PACK: 0603; TOL: 1%
R3 = rcl-amber:R; HEIGHT: 0.35mm; MANUFACTURER: Yageo; NR: RC0402FR-072K2L; P: 1/16W; PACK: 0402; TOL: 1%
R5 = rcl-amber:R; HEIGHT: 0.35mm; MANUFACTURER: Yageo; NR: RC0402FR-074K7L; P: 0.063W; PACK: 0402; TOL: 1%
R6 = rcl-WE:R; HEIGHT: 0.35mm; HERSTELLER: Yageo; NR: RC0402FR-075K1L
R7 R20 = rcl-WE:R; HEIGHT: 0.35mm; HERSTELLER: Yageo; NR: RC0402FR-07100KL; PACK: 0402; TOL: 1%
R8 = rcl-amber:R; HEIGHT: 0.35mm; MANUFACTURER: Yageo; NR: RC0402FR-07100KL; P: 1/16W; PACK: 0402; TOL: 1%
R9 = rcl-amber:R; HEIGHT: 0.35mm; MANUFACTURER: Yageo; NR: RC0402FR-0710KL; P: 1/16W; PACK: 0402; TOL: 1%
R10 R11 R14 R15 R18 R19 R22-R25 = rcl-amber:R; HEIGHT: 0.35mm; MANUFACTURER: Yageo; NR: RC0402FR-0710RL; P: 0.063W; PACK: 0402; TOL: 1%
R12 = rcl-amber:R; HEIGHT: 0.35mm; MANUFACTURER: Yageo; NR: RC0402FR-0712KL; P: 1/16W; PACK: 0402; TOL: 1%
R13 = rcl-amber:R; HEIGHT: 0.35mm; MANUFACTURER: Yageo; NR: RC0402FR-071KL; P: 0.063W; PACK: 0402; TOL: 1%
R16 R17 = rcl-WE:R; HEIGHT: 0.35mm; PACK: 0402
R34 R35 = rcl-amber:R; HEIGHT: 0.35mm; MANUFACTURER: Yageo; NR: RC0402FR-070RL; P: 1/16W; PACK: 0402; TOL: 5%
R42 = rcl-amber:R; HEIGHT: 0.35mm; MANUFACTURER: Yageo; NR: RC0402FR-07100RL; P: 0.063W; PACK: 0402; TOL: 1%
R43 = rcl-amber:R; HEIGHT: 0.35mm; MANUFACTURER: Yageo; NR: RC0402FR-071KL; P: 1/16W; PACK: 0402; TOL: 1%
S1 S2 = 434331013822_Eagle_WS-TASU_rev19b:434331013822: WS-TASU Side push Tact Switch, SMD version Specification Rating : 50mA, 12VDC Contact Resistance Initial: 100mΩ max. After life test:1mΩ max. Insulation Resistance: min.100MΩ at 500VDC Dielectric Strength : 250VAC for 1 minute Stroke:0.2+0.2/-0.1mm Bounce :10ms max. Material Cover : : Stainless steel Stem :PA46 UL HB. FramePA46 UL HB, color Black >Contact : Stainless Steel with Silver Tape:Polyimide tape Terminal : Copper Alloy with Silver <http://katalog.we-online.de/media/images/v2/Family_WS-TASU_434331013822_c.jpg> Details see: http://katalog.we-online.de/en/em/TASU_3_5X2_9_SMD_SIDE_PUSH/434331013822 2015 (C) Würth Elektronik
T1 = transistor:BSS138: BSS138 N-Channel Logic Level Enhancement Mode Field Effect Transistor; DESCRIPTION: Mosfet n-Ch 50v 220ma Die; HEIGHT: 1.1mm; MANUFACTURER: ON seminconductor; NR: BSS138; PACK: TO-236-3 Micross; PRICE: None
TP1-TP12 = testpad:TP15R

## Net classes
0 default: width 0.15 mm, drill 0.2 mm, clearance 0.15 mm
1 VCC: width 0.2 mm, drill 0.2 mm, clearance 0.2 mm to class 0, clearance 0.2 mm
4 VDDIO: width 0.2 mm, drill 0.2 mm, clearance 0.2 mm to class 0, clearance 0.2 mm to class 1, clearance 0.2 mm to class 2, clearance 0.2 mm to class 3, clearance 0.2 mm